# Altium schematic sheet 05_LMS7002M_1_RF.SchDoc: LMS7002M #1 RF
size A3; Organization: Lime Microsystems; Address1: Surrey Tech Centre; Address2: Guildford GU2 7YG; Address3: Surrey; Address4: United Kingdom; Revision: v1.2; SheetNumber: 5; SheetTotal: 27
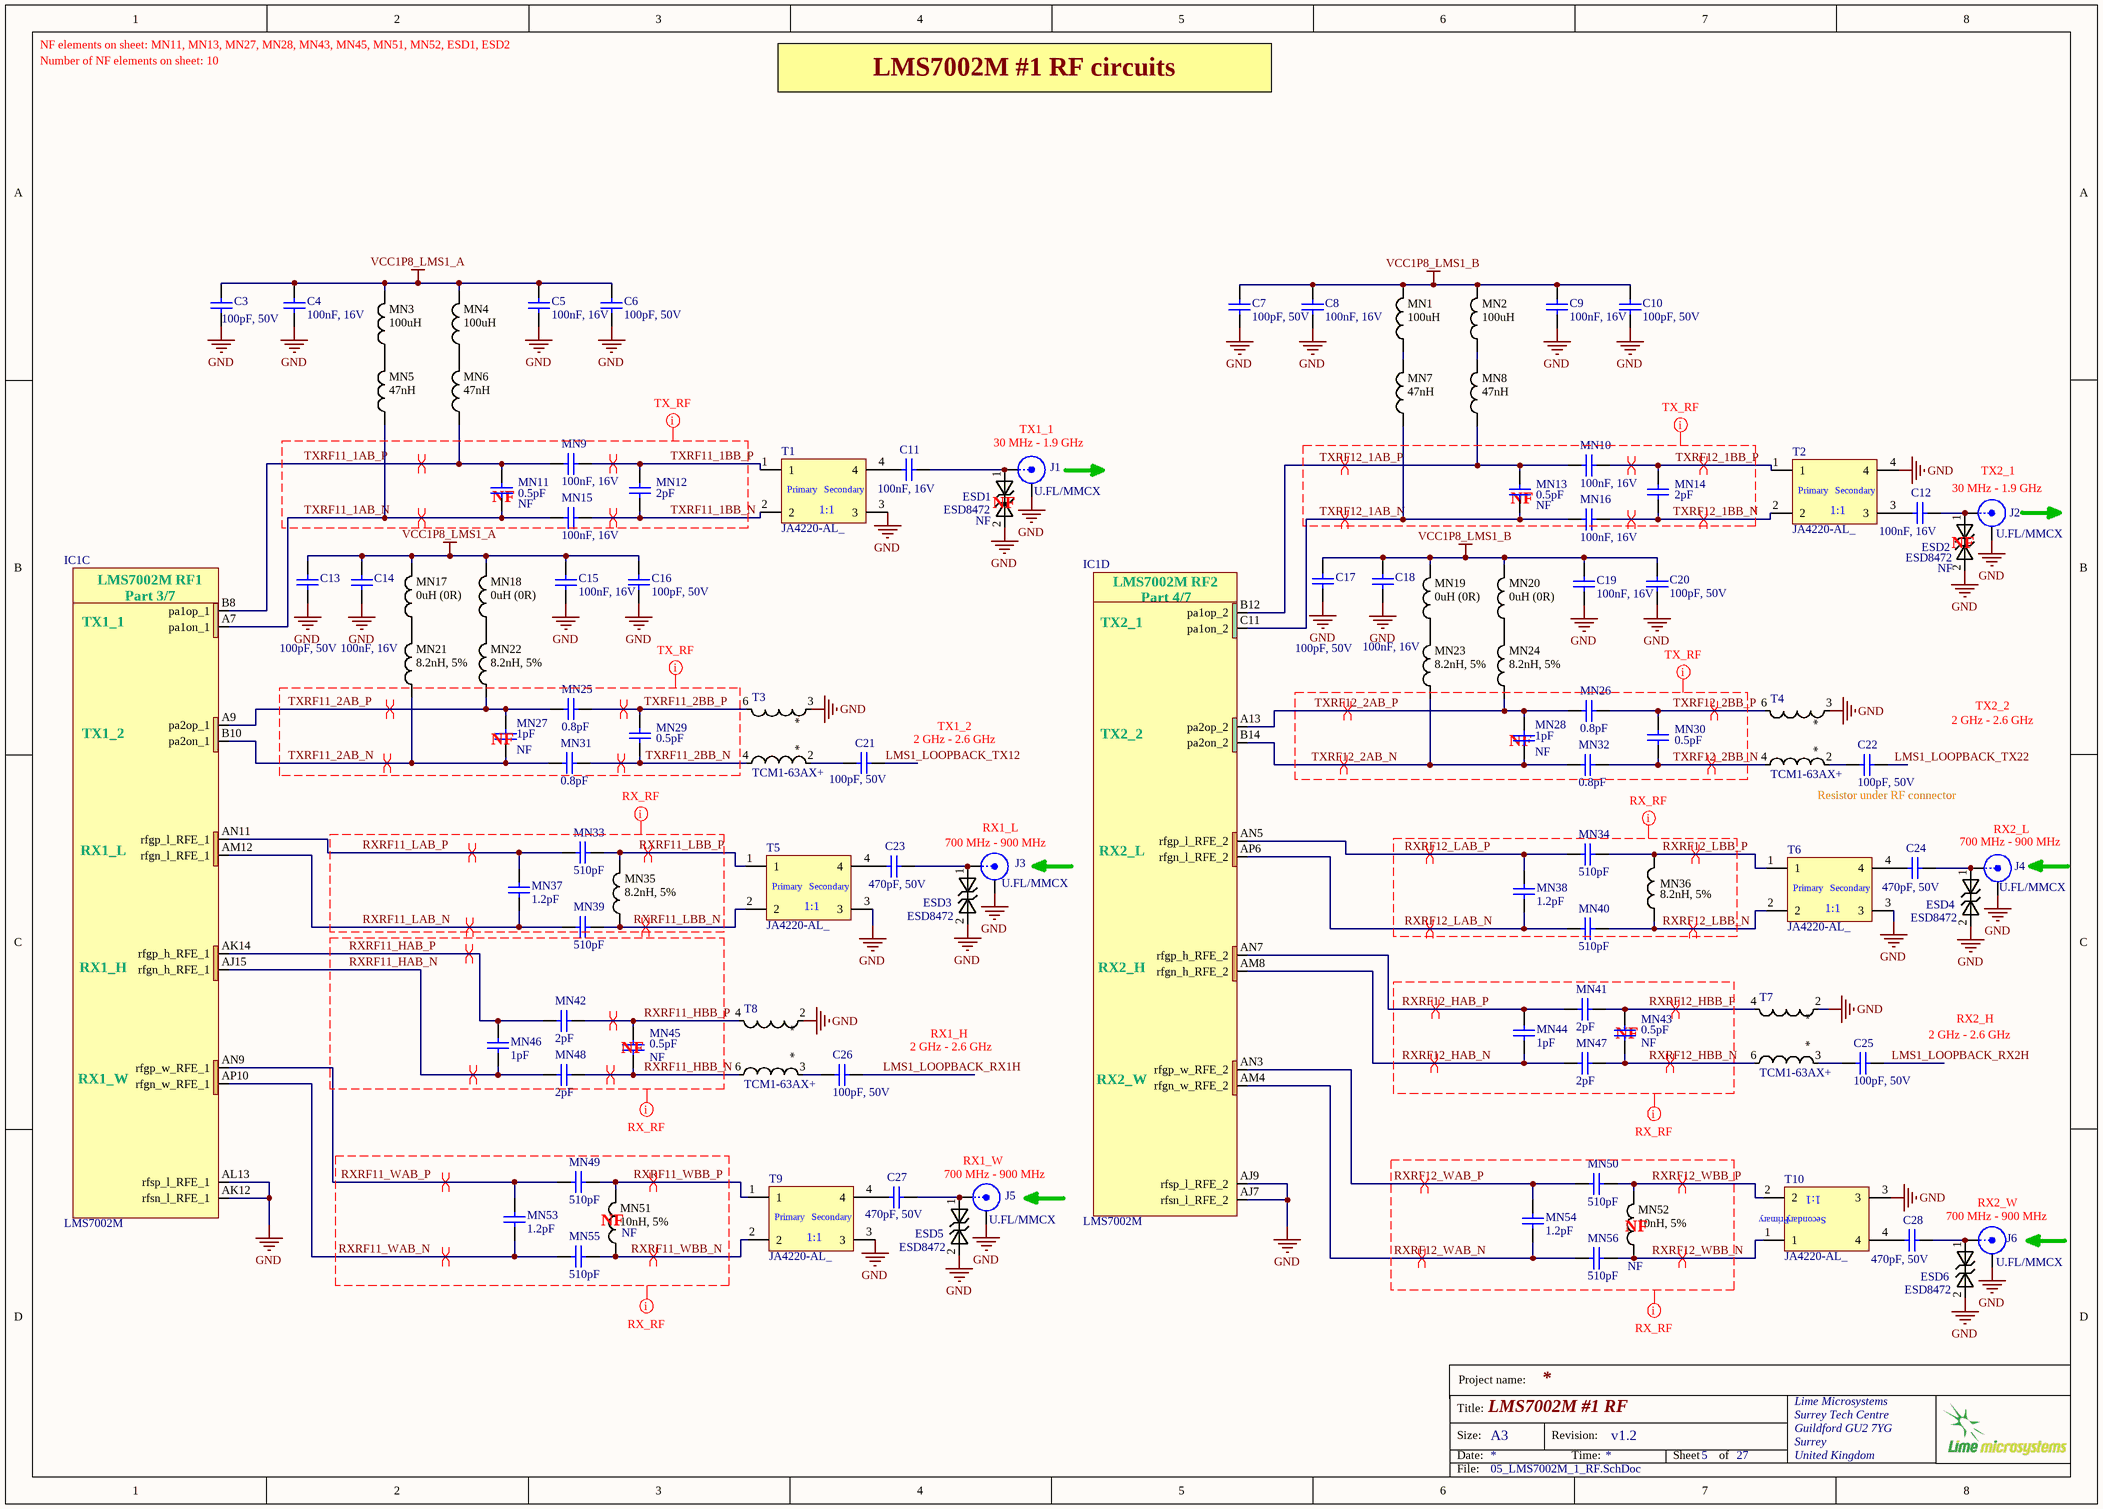
[diagram p0: 05_LMS7002M_1_RF.SchDoc]

## Parts
C3  100pF, 50V  [CAP0402]
C4  100nF, 16V  [CAP0402]
C5  100nF, 16V  [CAP0402]
C6  100pF, 50V  [CAP0402]
C7  100pF, 50V  [CAP0402]
C8  100nF, 16V  [CAP0402]
C9  100nF, 16V  [CAP0402]
C10  100pF, 50V  [CAP0402]
C11  100nF, 16V  [CAP0402]
C12  100nF, 16V  [CAP0402]
C13  100pF, 50V  [CAP0402]
C14  100nF, 16V  [CAP0402]
C15  100nF, 16V  [CAP0402]
C16  100pF, 50V  [CAP0402]
C17  100pF, 50V  [CAP0402]
C18  100nF, 16V  [CAP0402]
C19  100nF, 16V  [CAP0402]
C20  100pF, 50V  [CAP0402]
C21  100pF, 50V  [CAP0402]
C22  100pF, 50V  [CAP0402]
C23  470pF, 50V  [CAP0402]
C24  470pF, 50V  [CAP0402]
C25  100pF, 50V  [CAP0402]
C26  100pF, 50V  [CAP0402]
C27  470pF, 50V  [CAP0402]
C28  470pF, 50V  [CAP0402]
ESD1  ESD8472  Assembly Info: NF  [ESD8472_X3DFN2]
ESD2  ESD8472  Assembly Info: NF  [ESD8472_X3DFN2]
ESD3  ESD8472  [ESD8472_X3DFN2]
ESD4  ESD8472  [ESD8472_X3DFN2]
ESD5  ESD8472  [ESD8472_X3DFN2]
ESD6  ESD8472  [ESD8472_X3DFN2]
IC1  LMS7002M  [LMS7002M_v4]  (parts C,D of 7)
J1  U.FL/MMCX  [MMCX_UFL_conn_u]
J2  U.FL/MMCX  [MMCX_UFL_conn_u]
J3  U.FL/MMCX  [MMCX_UFL_conn_u]
J4  U.FL/MMCX  [MMCX_UFL_conn_u]
J5  U.FL/MMCX  [MMCX_UFL_conn_u]
J6  U.FL/MMCX  [MMCX_UFL_conn_u]
MN1  100uH  [RES0805]
MN2  100uH  [RES0805]
MN3  100uH  [RES0805]
MN4  100uH  [RES0805]
MN5  47nH  [RES0402]
MN6  47nH  [RES0402]
MN7  47nH  [RES0402]
MN8  47nH  [RES0402]
MN9  100nF, 16V  [CAP0402]
MN10  100nF, 16V  [CAP0402]
MN11  0.5pF  Assembly Info: NF  [CAP0402]
MN12  2pF  [CAP0402]
MN13  0.5pF  Assembly Info: NF  [CAP0402]
MN14  2pF  [CAP0402]
MN15  100nF, 16V  [CAP0402]
MN16  100nF, 16V  [CAP0402]
MN17  0uH (0R)  [RES0805]
MN18  0uH (0R)  [RES0805]
MN19  0uH (0R)  [RES0805]
MN20  0uH (0R)  [RES0805]
MN21  8.2nH, 5%  [RES0402]
MN22  8.2nH, 5%  [RES0402]
MN23  8.2nH, 5%  [RES0402]
MN24  8.2nH, 5%  [RES0402]
MN25  0.8pF  [CAP0402]
MN26  0.8pF  [CAP0402]
MN27  1pF  Assembly Info: NF  [CAP0402]
MN28  1pF  Assembly Info: NF  [CAP0402]
MN29  0.5pF  [CAP0402]
MN30  0.5pF  [CAP0402]
MN31  0.8pF  [CAP0402]
MN32  0.8pF  [CAP0402]
MN33  510pF  [CAP0402]
MN34  510pF  [CAP0402]
MN35  8.2nH, 5%  [RES0402]
MN36  8.2nH, 5%  [RES0402]
MN37  1.2pF  [CAP0402]
MN38  1.2pF  [CAP0402]
MN39  510pF  [CAP0402]
MN40  510pF  [CAP0402]
MN41  2pF  [CAP0402]
MN42  2pF  [CAP0402]
MN43  0.5pF  Assembly Info: NF  [CAP0402]
MN44  1pF  [CAP0402]
MN45  0.5pF  Assembly Info: NF  [CAP0402]
MN46  1pF  [CAP0402]
MN47  2pF  [CAP0402]
MN48  2pF  [CAP0402]
MN49  510pF  [CAP0402]
MN50  510pF  [CAP0402]
MN51  10nH, 5%  Assembly Info: NF  [RES0402]
MN52  10nH, 5%  Assembly Info: NF  [RES0402]
MN53  1.2pF  [CAP0402]
MN54  1.2pF  [CAP0402]
MN55  510pF  [CAP0402]
MN56  510pF  [CAP0402]
T1  JA4220-AL_  [JA4220-AL_]
T2  JA4220-AL_  [JA4220-AL_]
T3  TCM1-63AX+  [TCM1-63AX+_v2]
T4  TCM1-63AX+  [TCM1-63AX+_v2]
T5  JA4220-AL_  [JA4220-AL_]
T6  JA4220-AL_  [JA4220-AL_]
T7  TCM1-63AX+  [TCM1-63AX+_v2]
T8  TCM1-63AX+  [TCM1-63AX+_v2]
T9  JA4220-AL_  [JA4220-AL_]
T10  JA4220-AL_  [JA4220-AL_]

## Nets
GND: C3.2 C4.1 C5.1 C6.2 C7.2 C8.1 C9.1 C10.2 C13.2 C14.1 C15.1 C16.2 C17.2 C18.1 C19.1 C20.2 ESD1.2 ESD2.2 ESD3.2 ESD4.2 ESD5.2 ESD6.2 IC1.AJ7(rfsn_l_RFE_2) IC1.AJ9(rfsp_l_RFE_2) IC1.AK12(rfsn_l_RFE_1) IC1.AL13(rfsp_l_RFE_1) J1.2(Y) J2.2(Y) J3.2(Y) J4.2(Y) J5.2(Y) J6.2(Y) T1.3 T2.4 T3.3 T4.3 T5.3 T6.3 T7.2 T8.2 T9.3 T10.3
VCC1P8_LMS1_A: C3.1 C4.2 C5.2 C6.1 C13.1 C14.2 C15.2 C16.1 MN3.2 MN4.2 MN17.2 MN18.2
VCC1P8_LMS1_B: C7.1 C8.2 C9.2 C10.1 C17.1 C18.2 C19.2 C20.1 MN1.2 MN2.2 MN19.2 MN20.2
LMS1_LOOPBACK_RX1H: C26.1
LMS1_LOOPBACK_RX2H: C25.1
LMS1_LOOPBACK_TX12: C21.1
LMS1_LOOPBACK_TX22: C22.1
RXRF11_HAB_N: IC1.AJ15(rfgn_h_RFE_1) MN46.1 MN48.2
RXRF11_HAB_P: IC1.AK14(rfgp_h_RFE_1) MN42.2 MN46.2
RXRF11_HBB_N: MN45.1 MN48.1 T8.6
RXRF11_HBB_P: MN42.1 MN45.2 T8.4
RXRF11_LAB_N: IC1.AM12(rfgn_l_RFE_1) MN37.1 MN39.2
RXRF11_LAB_P: IC1.AN11(rfgp_l_RFE_1) MN33.2 MN37.2
RXRF11_LBB_N: MN35.1 MN39.1 T5.2
RXRF11_LBB_P: MN33.1 MN35.2 T5.1
RXRF11_WAB_N: IC1.AP10(rfgn_w_RFE_1) MN53.2 MN55.2
RXRF11_WAB_P: IC1.AN9(rfgp_w_RFE_1) MN49.2 MN53.1
RXRF11_WBB_N: MN51.1 MN55.1 T9.2
RXRF11_WBB_P: MN49.1 MN51.2 T9.1
RXRF12_HAB_N: IC1.AM8(rfgn_h_RFE_2) MN44.1 MN47.2
RXRF12_HAB_P: IC1.AN7(rfgp_h_RFE_2) MN41.2 MN44.2
RXRF12_HBB_N: MN43.1 MN47.1 T7.6
RXRF12_HBB_P: MN41.1 MN43.2 T7.4
RXRF12_LAB_N: IC1.AP6(rfgn_l_RFE_2) MN38.1 MN40.2
RXRF12_LAB_P: IC1.AN5(rfgp_l_RFE_2) MN34.2 MN38.2
RXRF12_LBB_N: MN36.1 MN40.1 T6.2
RXRF12_LBB_P: MN34.1 MN36.2 T6.1
RXRF12_WAB_N: IC1.AM4(rfgn_w_RFE_2) MN54.2 MN56.2
RXRF12_WAB_P: IC1.AN3(rfgp_w_RFE_2) MN50.2 MN54.1
RXRF12_WBB_N: MN52.1 MN56.1 T10.1
RXRF12_WBB_P: MN50.1 MN52.2 T10.2
TXRF11_1AB_N: IC1.A7(pa1on_1) MN5.1 MN11.1 MN15.1
TXRF11_1AB_P: IC1.B8(pa1op_1) MN6.1 MN9.2 MN11.2
TXRF11_1BB_N: MN12.1 MN15.2 T1.2
TXRF11_1BB_P: MN9.1 MN12.2 T1.1
TXRF11_2AB_N: IC1.B10(pa2on_1) MN21.1 MN27.2 MN31.2
TXRF11_2AB_P: IC1.A9(pa2op_1) MN22.1 MN25.2 MN27.1
TXRF11_2BB_N: MN29.1 MN31.1 T3.4
TXRF11_2BB_P: MN25.1 MN29.2 T3.6
TXRF12_1AB_N: IC1.C11(pa1on_2) MN7.1 MN13.1 MN16.1
TXRF12_1AB_P: IC1.B12(pa1op_2) MN8.1 MN10.2 MN13.2
TXRF12_1BB_N: MN14.1 MN16.2 T2.2
TXRF12_1BB_P: MN10.1 MN14.2 T2.1
TXRF12_2AB_N: IC1.B14(pa2on_2) MN23.1 MN28.2 MN32.2
TXRF12_2AB_P: IC1.A13(pa2op_2) MN24.1 MN26.2 MN28.1
TXRF12_2BB_N: MN30.1 MN32.1 T4.4
TXRF12_2BB_P: MN26.1 MN30.2 T4.6
NetC11_1: C11.1 ESD1.1 J1.1(X)
NetC11_2: C11.2 T1.4
NetC12_1: C12.1 ESD2.1 J2.1(X)
NetC12_2: C12.2 T2.3
NetC21_2: C21.2 T3.2
NetC22_2: C22.2 T4.2
NetC23_1: C23.1 ESD3.1 J3.1(X)
NetC23_2: C23.2 T5.4
NetC24_1: C24.1 ESD4.1 J4.1(X)
NetC24_2: C24.2 T6.4
NetC25_2: C25.2 T7.3
NetC26_2: C26.2 T8.3
NetC27_1: C27.1 ESD5.1 J5.1(X)
NetC27_2: C27.2 T9.4
NetC28_1: C28.1 ESD6.1 J6.1(X)
NetC28_2: C28.2 T10.4
NetMN1_1: MN1.1 MN7.2
NetMN2_1: MN2.1 MN8.2
NetMN3_1: MN3.1 MN5.2
NetMN4_1: MN4.1 MN6.2
NetMN17_1: MN17.1 MN21.2
NetMN18_1: MN18.1 MN22.2
NetMN19_1: MN19.1 MN23.2
NetMN20_1: MN20.1 MN24.2

## Layout directives
differential pair: RXRF11_HAB_N, RXRF11_HAB_P, RXRF11_HBB_N, RXRF11_HBB_P, RXRF11_LAB_N, RXRF11_LAB_P, RXRF11_LBB_N, RXRF11_LBB_P, RXRF11_WAB_N, RXRF11_WAB_P, RXRF11_WBB_N, RXRF11_WBB_P, RXRF12_HAB_N, RXRF12_HAB_P, RXRF12_HBB_N, RXRF12_HBB_P, RXRF12_LAB_N, RXRF12_LAB_P, RXRF12_LBB_N, RXRF12_LBB_P, RXRF12_WAB_N, RXRF12_WAB_P, RXRF12_WBB_N, RXRF12_WBB_P, TXRF11_1AB_N, TXRF11_1AB_P, TXRF11_1BB_N, TXRF11_1BB_P, TXRF11_2AB_N, TXRF11_2AB_P, TXRF11_2BB_N, TXRF11_2BB_P, TXRF12_1AB_N, TXRF12_1AB_P, TXRF12_1BB_N, TXRF12_1BB_P, TXRF12_2AB_N, TXRF12_2AB_P, TXRF12_2BB_N, TXRF12_2BB_P
net class TX_RF: TXRF11_1AB_N, TXRF11_1AB_P, TXRF11_1BB_N, TXRF11_1BB_P, TXRF11_2AB_N, TXRF11_2AB_P, TXRF11_2BB_N, TXRF11_2BB_P, TXRF12_1AB_N, TXRF12_1AB_P, TXRF12_1BB_N, TXRF12_1BB_P, TXRF12_2AB_N, TXRF12_2AB_P, TXRF12_2BB_N, TXRF12_2BB_P
net class RX_RF: RXRF11_HAB_N, RXRF11_HAB_P, RXRF11_HBB_N, RXRF11_HBB_P, RXRF11_LAB_N, RXRF11_LAB_P, RXRF11_LBB_N, RXRF11_LBB_P, RXRF11_WAB_N, RXRF11_WAB_P, RXRF11_WBB_N, RXRF11_WBB_P, RXRF12_HAB_N, RXRF12_HAB_P, RXRF12_HBB_N, RXRF12_HBB_P, RXRF12_LAB_N, RXRF12_LAB_P, RXRF12_LBB_N, RXRF12_LBB_P, RXRF12_WAB_N, RXRF12_WAB_P, RXRF12_WBB_N, RXRF12_WBB_P

## Notes on the sheet
- Number of NF elements on sheet: 10
- NF elements on sheet: MN11, MN13, MN27, MN28, MN43, MN45, MN51, MN52, ESD1, ESD2
- LMS7002M #1 RF circuits
- 30 MHz - 1.9 GHz
- TX1_1
- (near MN11) NF
- (near ESD1) NF
- (near MN13) NF
- TX2_1
- (near ESD2) NF
- TX2_2
- (near MN27) NF
- (near C21) 2 GHz - 2.6 GHz
- TX1_2
- (near MN28) NF
- 2 GHz - 2.6 GHz
- 700 MHz - 900 MHz
- RX1_L
- Resistor under RF connector
- RX2_L
- (near MN45) NF
- RX1_H
- (near MN43) NF
- RX2_H
- RX1_W
- (near MN51) NF
- (near MN52) NF
- RX2_W
- Project name:
- Title:
- Size:
- Date:
- A3
- Revision:
- Time:
- Sheet
- of
- File:
- (in symbol JA4220-AL_) Primary; Secondary; 1:1
- (in symbol LMS7002Mr3, part C) LMS7002M RF1; Part 3/7; TX1_1; TX1_2; RX1_L; RX1_H; RX1_W
- (in symbol LMS7002Mr3, part D) LMS7002M RF2; Part 4/7; TX2_1; TX2_2; RX2_L; RX2_H; RX2_W

## Library data of the parts
C3 C6 C7 C10 C13 C16 C17 C20 = Cap_0402: Manufacturer: Yageo; Manufacturer Part Number 1: CC0402JRNPO9BN101; Part Description: 100pF ±5% 50V C0G, NP0 Ceramic Capacitor -55°C ~ 125°C Surface Mount, MLCC 0402 (1005 Metric) 0.039" L x 0.020" W (1.00mm x 0.50mm); Temperature Coefficient: C0G, NP0; Tolerance: ±5%; Value: 100pF, 50V; Supplier 1: Digi-Key; Supplier Part Number 1: 311-1024-1-ND; Category: Capacitors; Features: -; Operating Temperature: -55°C ~ 125°C; Capacitance: 100pF; Thickness (Max): 0.022" (0.55mm); RoHS: RoHS Compliant; Voltage - Rated: 50V; Lead Style: -; Ratings: -; Size / Dimension: 0.039" L x 0.020" W (1.00mm x 0.50mm); Height - Seated (Max): -; Applications: General Purpose; Package / Case: 0402 (1005 Metric); Lead Spacing: -; Packaging: Tape & Reel (TR); Mounting Type: Surface Mount, MLCC
C4 C5 C8 C9 C11 C12 C14 C15 C18 C19 = Cap_0402: Manufacturer: Murata Electronics; Manufacturer Part Number: GRM155R71C104KA88D; Part Description: 0.10µF ±10% 16V Ceramic Capacitor X7R 0402 (1005 Metric); Tolerance: 10 %; Type: General Purpose MLCC; Capacitance: 0.1 uF; Case Length: 1 mm; Dielectric: X7R; Case Height: 0.5 mm; Temperature Coefficient / Code: +/- 15 %; Value: 100nF, 16V; Supplier 1: Mouser; Supplier Part Number 1: 81-GRM155R71C104KA88; Case Code - in: 0402; RoHS: RoHS Compliant; Operating Temperature Range: - 55 C to + 125 C; Series: GRM; Termination Style: SMD/SMT; Package / Case: 0402 (1005 metric); Voltage Rating DC: 16 V; Maximum Operating Temperature: + 125 C; Case Code - mm: 1005; Minimum Operating Temperature: - 55 C; Product Category: Low & Medium Capacitance SMD Ceramic Chip Capacitors; Packaging: Reel; Product: General Type MLCCs; Category: Multilayer Ceramic Capacitors MLCC - SMD/SMT; Brand: Murata Electronics; Case Width: 0.5 mm; RoHS - Mouser: Y; Standard Pack Qty: 10000; Minimum Order Quantity: 1; Reeling: True; Manufacturer Part Number 1: GRM155R71C104KA88D
C21 C22 C25 C26 = Cap_0402: Manufacturer Part Number 1: CC0402JRNPO9BN101; Manufacturer: Yageo; Part Description: 100pF ±5% 50V C0G, NP0 Ceramic Capacitor -55°C ~ 125°C Surface Mount, MLCC 0402 (1005 Metric) 0.039" L x 0.020" W (1.00mm x 0.50mm); Tolerance: ±5%; Temperature Coefficient: C0G, NP0; Value: 100pF, 50V; Capacitance: 100pF; Thickness (Max): 0.022" (0.55mm); Size / Dimension: 0.039" L x 0.020" W (1.00mm x 0.50mm); RoHS: RoHS Compliant; Ratings: -; Package / Case: 0402 (1005 Metric); Mounting Type: Surface Mount, MLCC; Height - Seated (Max): -; Features: -; Lead Spacing: -; Voltage - Rated: 50V; Operating Temperature: -55°C ~ 125°C; Packaging: Cut Tape (CT); Applications: General Purpose; Lead Style: -; Supplier 1: Digi-Key; Category: Capacitors; Supplier Part Number 1: 311-1024-1-ND
C23 C24 C27 C28 = Cap_0402: Manufacturer Part Number: C1005C0G1H471J050BA; Manufacturer: TDK Corporation; Part Description: 470pF ±5% 50V Ceramic Capacitor C0G, NP0 0402 (1005 Metric); Tolerance: ±5%; Temperature Coefficient: C0G, NP0; Value: 470pF, 50V; Supplier 1: Digi-Key; Supplier Part Number 1: 445-2656-6-ND; Ratings: -; Package / Case: 0402 (1005 Metric); Capacitance: 470pF; Packaging: Digi-Reel®; RoHS: RoHS Compliant; Lead Style: -; Thickness (Max): 0.022" (0.55mm); Size / Dimension: 0.039" L x 0.020" W (1.00mm x 0.50mm); Lead Spacing: -; Operating Temperature: -55°C ~ 125°C; Height - Seated (Max): -; Applications: General Purpose; Mounting Type: Surface Mount, MLCC; Voltage - Rated: 50V; Category: Capacitors; Features: -
ESD1-ESD6 = ESD8472: Manufacturer: ON Semiconductor; Manufacturer Part Number: ESD8472MUT5G; Part Description: TVS DIODE 5.3VWM 14VC X3DFN2; Voltage - Reverse Standoff (Typ): 5.3V (Max); Voltage - Breakdown (Min): 7V; Voltage - Clamping (Max) @ Ipp: 14V; Current - Peak Pulse (10/1000µs): 3A (8/20µs); Power Line Protection: No; Capacitance @ Frequency: 0.2pF @ 1MHz; Supplier 1: Digi-Key; RoHS: RoHS Compliant; Category: Circuit Protection; Stock 1: 2295; Pricing 1: 1=0.39, 10=0.315, 100=0.2142, 500=0.16068, 1000=0.12051 (USD); Packaging: Cut Tape (CT); Part Status: Active; Type: Zener; Power - Peak Pulse: -; Applications: Automotive, RF Antenna; Operating Temperature: -55°C ~ 150°C (TJ); Mounting Type: Surface Mount; Package / Case: 2-XFDFN; Supplier Device Package: 2-X3DFN (0.62x0.32); ComponentLink1URL: http://www.onsemi.com/pub/Collateral/ESD8472-D.PDF; ComponentLink1Description: http://www.onsemi.com/pub/Collateral/ESD8472-D.PDF; Supplier Part Number 1: ESD8472MUT5GOSCT-ND
IC1 = LMS7002Mr3: Schematic symbol revision 3. Default footprint - 0.31mm pad; Manufacturer: Lime Microsystems; Part Description: IC FPRF Transceiver LMS7002M; 261 pin aQFN; Supplier 1: Lime Microsystems; Supplier Part Number 1: LMS7002M; Manufacturer Part Number 1: LMS7002M
J1-J6 = RF_IF_connector: CONN UMC RCPT STR 50 OHM SMD; Manufacturer: Molex, LLC; Manufacturer Part Number 1: 0734120110; Part Description: Ultra Miniature Coaxial Connector Receptacle, Male Pin 50 Ohm Surface Mount Solder; Body Finish: Nickel; Body Material: Phosphor Bronze; Center Contact Material: Brass; Center Contact Plating: Gold; Connector Style: Ultra Miniature Coaxial; Connector Type: Jack, Male Pin; Contact Termination: Solder; Dielectric Material: Liquid Crystal Polymer (LCP); Frequency - Max: 6GHz; Impedance: 50 Ohm; Voltage Rating: 60V; Cable Group: -; Category: Connectors, Interconnects; Fastening Type: Snap-On; Features: -; Housing Color: Silver; Ingress Protection: -; Mounting Type: Surface Mount; Operating Temperature: -40°C ~ 90°C; Packaging: Cut Tape (CT); RoHS: RoHS Compliant; Shield Termination: Solder; Supplier 1: Digi-Key; Supplier Part Number 1: WM5587CT-ND
MN1-MN4 = Inductor_0603: Manufacturer: TDK Corporation; Manufacturer Part Number: MLF2012C101KT000; Part Description: 100µH Shielded Multilayer Inductor 2mA 3.1 Ohm Max 0805 (2012 Metric); Q @ Freq: 25 @ 1MHz; Shielding: Shielded; Current Rating: 2mA; Frequency - Self Resonant: 7MHz; Frequency - Test: 1MHz; Material - Core: Ferrite; Tolerance: ±10%; Inductance: 100µH; DC Resistance (DCR): 3.1 Ohm Max; Value: 100uH; Supplier 1: Digi-Key; Supplier Part Number 1: 445-1071-1-ND; Supplier Device Package: 0805 (2012 Metric); Size / Dimension: 0.079" L x 0.049" W (2.00mm x 1.25mm); Operating Temperature: -40°C ~ 85°C; Packaging: Cut Tape (CT); RoHS: RoHS Compliant; Current - Saturation: -; Height - Seated (Max): 0.057" (1.45mm); Package / Case: 0805 (2012 Metric); Mounting Type: Surface Mount; Type: Multilayer; Category: Inductors, Coils, Chokes
MN5-MN8 = Inductor_0603: Manufacturer: COILCRAFT; Manufacturer Part Number: 0402HP-47NXJLU; Part Description: COILCRAFT  0402HP-47NXJLU  Surface Mount High Frequency Inductor, 0402HP Series, 47 nH, 420 mA, 0402 [1005 Metric], Wirewound; SVHC: No SVHC (15-Jun-2015); Inductance Tolerance: ± 5%; High Frequency Inductor Case: 0402 [1005 Metric]; Inductor Case Style: 0402 [1005 Metric]<!--FANDB--><div class="features-and-benefits-container"></div>; Inductance: 47; DC Resistance Max: 0.58; Self Resonant Frequency Min: 2.4; Product Range: 0402; DC Current Rating: 420; Inductor Construction: Wirewound; Supplier 1: Farnell; Supplier Part Number 1: 2285856; Packaging: Cut Tape; RoHS: Y-EX; value: 47nH; Manufacturer Part Number 1: 0402HP-47NXJLU
MN9 MN10 MN15 MN16 = Cap_0402: Manufacturer: Murata Electronics; Manufacturer Part Number: GRM155R71C104KA88D; Part Description: 0.10µF ±10% 16V Ceramic Capacitor X7R 0402 (1005 Metric); Tolerance: 10 %; Capacitance: 0.1 uF; Case Length: 1 mm; Dielectric: X7R; Case Height: 0.5 mm; Temperature Coefficient / Code: +/- 15 %; Value: 100nF, 16V; Supplier 1: Mouser; Supplier Part Number 1: 81-GRM155R71C104KA88; Case Code - in: 0402; RoHS: RoHS Compliant; Operating Temperature Range: - 55 C to + 125 C; Series: GRM; Termination Style: SMD/SMT; Package / Case: 0402 (1005 metric); Voltage Rating DC: 16 V; Type: General Purpose MLCC; Maximum Operating Temperature: + 125 C; Case Code - mm: 1005; Minimum Operating Temperature: - 55 C; Product Category: Low & Medium Capacitance SMD Ceramic Chip Capacitors; Packaging: Reel; Product: General Type MLCCs; Category: Multilayer Ceramic Capacitors MLCC - SMD/SMT; Brand: Murata Electronics; Case Width: 0.5 mm; RoHS - Mouser: Y; Standard Pack Qty: 10000; Minimum Order Quantity: 1; Reeling: True; Manufacturer Part Number 1: GRM155R71C104KA88D
MN11 MN13 MN29 MN30 MN43 MN45 = Cap_0402: Manufacturer: Yageo; Manufacturer Part Number 1: CC0402CRNPO9BNR50; Part Description: 0.50pF ±0.25pF 50V Ceramic Capacitor C0G, NP0 0402 (1005 Metric); Capacitance: 0.50pF; Voltage - Rated: 50V; Temperature Coefficient: C0G, NP0; Tolerance: ±0.25pF; Value: 0.5pF; Supplier 1: Digi-Key; Supplier Part Number 1: 311-1001-1-ND; RoHS: RoHS Compliant; Thickness (Max): 0.022" (0.55mm); Features: -; Height - Seated (Max): -; Lead Spacing: -; Applications: General Purpose; Packaging: Cut Tape (CT); Ratings: -; Size / Dimension: 0.039" L x 0.020" W (1.00mm x 0.50mm); Lead Style: -; Mounting Type: Surface Mount, MLCC; Operating Temperature: -55°C ~ 125°C; Package / Case: 0402 (1005 Metric); Category: Capacitors
MN12 MN14 MN41 MN42 MN47 MN48 = Cap_0402: Manufacturer: AVX; Manufacturer Part Number 1: 04025U2R0BAT2A; Part Description: 2pF ±0.1pF 50V Ceramic Capacitor C0G, NP0 0402 (1005 Metric); Product Range: U Series; Voltage Rating: 50; SVHC: No SVHC (17-Dec-2014); Capacitance Tolerance: ± 0.1; Ceramic Capacitor Case: 0402 [1005 Metric]; Capacitance: 2; Dielectric Characteristic: C0G / NP0; Value: 2pF; Supplier 1: Farnell; Supplier Part Number 1: 2332536; Operating Temperature Max: 125; RoHS: YES; Operating Temperature Min: -55; Capacitance Tolerance ±: ± 0.1; Packaging: Cut Tape; MSL: MSL 1 - Unlimited
MN17-MN20 = Inductor_0603: Manufacturer: BOURNS; Manufacturer Part Number 1: CR0805-J/-000ELF; Part Description: RES SMD 0.0 OHM JUMPER 1/8W 0805; Value: 0uH (0R); Supplier 1: Farnell; Supplier Part Number 1: 2008388; RoHS: YES
MN21-MN24 MN35 MN36 = Inductor_0603: Manufacturer: COILCRAFT; Manufacturer Part Number 1: 0402HP-8N2XJLU; Part Description: Surface Mount High Frequency Inductor, 0402HP Series, 8.2 nH, 1.5 A, 0402 [1005 Metric], Wirewound; Inductor Construction: Wirewound; DC Current Rating: 1.5; Inductor Case Style: 0402 [1005 Metric]<!--FANDB--><div class="features-and-benefits-container"></div>; Self Resonant Frequency Min: 5.4; DC Resistance Max: 0.065; High Frequency Inductor Case: 0402 [1005 Metric]; SVHC: No SVHC (16-Jun-2014); Inductance: 8.2; Supplier 1: Farnell; Supplier Part Number 1: 2285826; Packaging: Cut Tape; Product Range: COILCRAFT - 0402; Inductance Tolerance: ± 5%; RoHS: Y-EX; Value: 8.2nH, 5%
MN25 MN26 MN31 MN32 = Cap_0402: Manufacturer: Murata Electronics North America; Manufacturer Part Number 1: GRM1555C1HR80BA01D; Part Description: 0.80pF ±0.1pF 50V Ceramic Capacitor C0G, NP0 0402 (1005 Metric); Temperature Coefficient: C0G, NP0; Capacitance: 0.80pF; Voltage - Rated: 50V; Tolerance: ±0.1pF; Value: 0.8pF; Applications: General Purpose; Operating Temperature: -55°C ~ 125°C; Size / Dimension: 0.039" L x 0.020" W (1.00mm x 0.50mm); Features: -; Supplier 1: Digi-Key; Height - Seated (Max): -; Category: Capacitors; Package / Case: 0402 (1005 Metric); Mounting Type: Surface Mount, MLCC; Lead Spacing: -; Thickness (Max): 0.022" (0.55mm); RoHS: RoHS Compliant; Supplier Part Number 1: 490-6269-1-ND; Packaging: Cut Tape (CT); Ratings: -; Lead Style: -
MN27 MN28 MN44 MN46 = Cap_0402: Manufacturer: TDK Corporation; Manufacturer Part Number 1: C1005C0G1H010B050BA; Part Description: 1pF ±0.1pF 50V Ceramic Capacitor C0G, NP0 0402 (1005 Metric); Voltage - Rated: 50V; Temperature Coefficient: C0G, NP0; Tolerance: ±0.1pF; Value: 1pF; Supplier 1: Digi-Key; Supplier Part Number 1: 445-4854-6-ND; Size / Dimension: 0.039" L x 0.020" W (1.00mm x 0.50mm); Lead Spacing: -; Operating Temperature: -55°C ~ 125°C; Thickness (Max): 0.022" (0.55mm); Package / Case: 0402 (1005 Metric); Features: -; Lead Style: -; Applications: General Purpose; Height - Seated (Max): -; Capacitance: 1pF; RoHS: RoHS Compliant; Mounting Type: Surface Mount, MLCC; Packaging: Digi-Reel®; Ratings: -; Category: Capacitors
MN33 MN34 MN39 MN40 MN49 MN50 MN55 MN56 = Cap_0402: Manufacturer: Murata Electronics North America; Manufacturer Part Number 1: GRM1555C1H511JA01D; Part Description: 510pF ±5% 50V Ceramic Capacitor C0G, NP0 0402 (1005 Metric); Voltage - Rated: 50V; Temperature Coefficient: C0G, NP0; Tolerance: ±5%; Value: 510pF; Supplier 1: Digi-Key; Supplier Part Number 1: 490-3237-1-ND; Height - Seated (Max): -; Features: -; Size / Dimension: 0.039" L x 0.020" W (1.00mm x 0.50mm); Applications: General Purpose; Lead Spacing: -; Package / Case: 0402 (1005 Metric); Ratings: -; Thickness (Max): 0.022" (0.55mm); Lead Style: -; Operating Temperature: -55°C ~ 125°C; Mounting Type: Surface Mount, MLCC; Capacitance: 510pF; Category: Capacitors; RoHS: RoHS Compliant; Packaging: Cut Tape (CT)
MN37 MN38 MN53 MN54 = Cap_0402: Manufacturer: Murata Electronics North America; Manufacturer Part Number 1: GRM1555C1H1R2CA01D; Part Description: 1.2pF ±0.25pF 50V Ceramic Capacitor C0G, NP0 0402 (1005 Metric); Temperature Coefficient: C0G, NP0; Voltage - Rated: 50V; Tolerance: ±0.25pF; Value: 1.2pF; Supplier 1: Digi-Key; Supplier Part Number 1: 490-5927-1-ND; Lead Style: -; Category: Capacitors; Features: -; Packaging: Cut Tape (CT); Operating Temperature: -55°C ~ 125°C; Package / Case: 0402 (1005 Metric); Applications: General Purpose; Size / Dimension: 0.039" L x 0.020" W (1.00mm x 0.50mm); Lead Spacing: -; Ratings: -; Mounting Type: Surface Mount, MLCC; RoHS: RoHS Compliant; Height - Seated (Max): -; Thickness (Max): 0.022" (0.55mm); Capacitance: 1.2pF
MN51 MN52 = Inductor_0603: Manufacturer: COILCRAFT; Part Description: Surface Mount High Frequency Inductor, 0402HP Series, 10 nH, 1.3 A, 0402 [1005 Metric], Wirewound; Manufacturer Part Number 1: 0402HP-10NXJLU; Value: 10nH, 5%; Supplier 1: Farnell; Supplier Part Number 1: 2285830; RoHS: Y-EX
T1 T2 T5 T6 T9 T10 = JA4220-AL_: Part Description: RF balun; 1:1 ratio; 3 dB bandwidth: 0.1 MHz to 3.5 GHz; 3.8mm x 3.8mm; Manufacturer: Coilcraft; Supplier 1: Coilcraft; Supplier Part Number: JA4220-AL_; Supplier Part Number 1: JA4220-AL_
T3 T4 T7 T8 = Balun_v2: Manufacturer: Mini-circuits; Part Description: BALUN WIDE BAND; Manufacturer Part Number 1: TCM1-63AX+; Supplier 1: Mini-circuits; Supplier Part Number 1: TCM1-63AX+